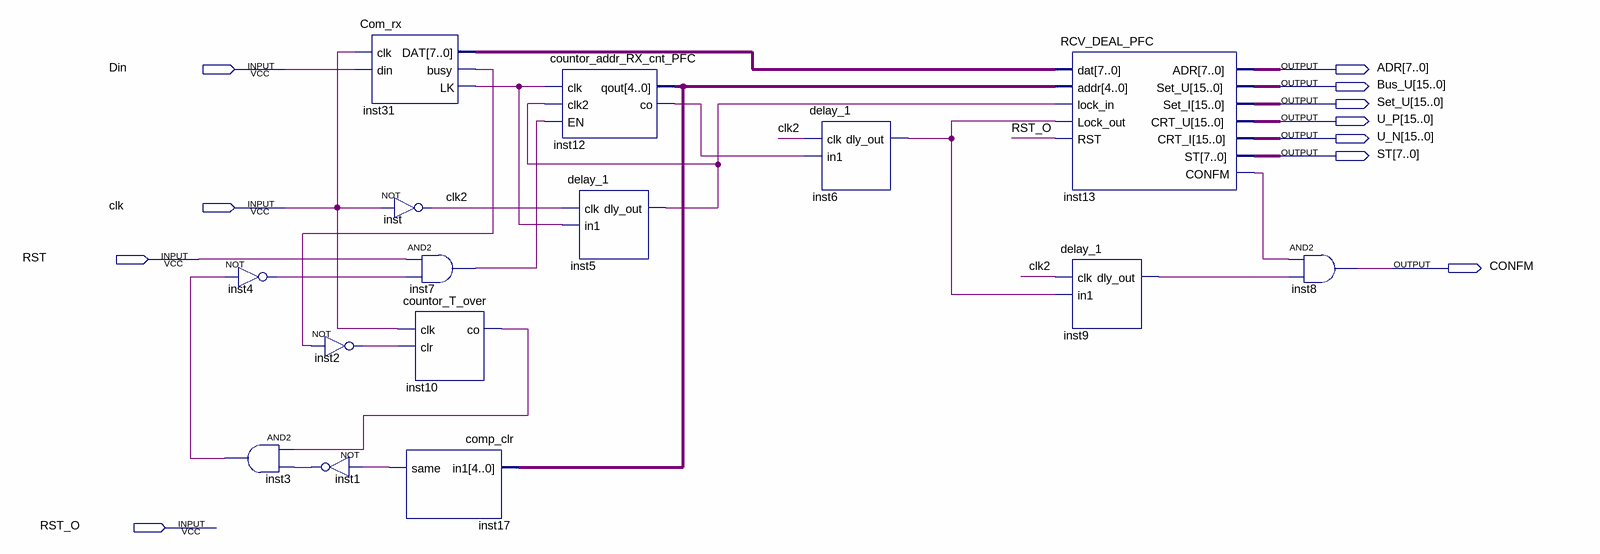
[diagram p0: schematic sheet]
// Quartus schematic Com_rx_PFC.bdf as structural Verilog: 15 symbols, 11 pins
module Com_rx_PFC (
  input  Din,
  input  clk,
  input  RST,
  input  RST_O,
  output [7:0] ADR,
  output [15:0] Bus_U,
  output [15:0] Set_U,
  output [15:0] U_P,
  output [15:0] U_N,
  output [7:0] ST,
  output CONFM
);

  wire clk2, inst1_out, inst2_out, inst3_out, inst4_out, inst5_dly_out, inst6_dly_out, inst7_out,
       inst9_dly_out, inst10_co, inst12_co, inst13_confm, inst17_same, inst31_busy, inst31_lk;
  wire [4:0] inst12_qout;
  wire [7:0] inst31_dat;

  not inst4 (inst4_out, inst3_out);
  and inst3 (inst3_out, inst10_co, inst1_out);
  not inst2 (inst2_out, inst31_busy);
  not inst1 (inst1_out, inst17_same);
  Com_rx inst31 (.clk(clk), .din(Din), .DAT(inst31_dat), .busy(inst31_busy), .LK(inst31_lk));
  not inst (clk2, clk);
  and inst7 (inst7_out, RST, inst4_out);
  countor_T_over inst10 (.clk(clk), .clr(inst2_out), .co(inst10_co));
  comp_clr inst17 (.in1(inst12_qout), .same(inst17_same));
  countor_addr_RX_cnt_PFC inst12 (
    .clk(inst31_lk), .clk2(inst5_dly_out), .EN(inst7_out), .qout(inst12_qout), .co(inst12_co));
  delay_1 inst5 (.clk(clk2), .in1(inst31_lk), .dly_out(inst5_dly_out));
  delay_1 inst6 (.clk(clk2), .in1(inst12_co), .dly_out(inst6_dly_out));
  RCV_DEAL_PFC inst13 (
    .dat(inst31_dat), .addr(inst12_qout), .lock_in(inst5_dly_out), .Lock_out(inst6_dly_out), .RST(RST_O),
    .ADR(ADR), .Set_U(Bus_U), .Set_I(Set_U), .CRT_U(U_P), .CRT_I(U_N), .ST(ST), .CONFM(inst13_confm));
  delay_1 inst9 (.clk(clk2), .in1(inst6_dly_out), .dly_out(inst9_dly_out));
  and inst8 (CONFM, inst13_confm, inst9_dly_out);
endmodule
